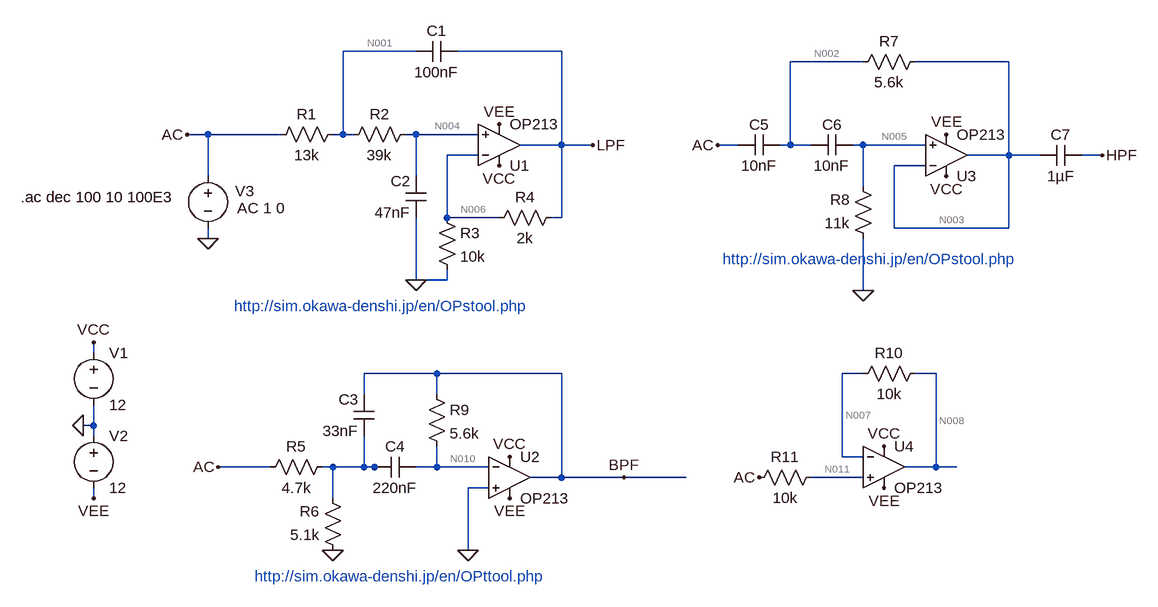
[diagram p0: schematic Active_Cross.asc]
Active_Cross.asc, the LTspice schematic file:
Version 4
SHEET 1 1848 680
WIRE 464 -432 352 -432
WIRE 688 -432 528 -432
WIRE 1152 -416 1040 -416
WIRE 1376 -416 1232 -416
WIRE 144 -304 112 -304
WIRE 256 -304 144 -304
WIRE 352 -304 352 -432
WIRE 352 -304 336 -304
WIRE 368 -304 352 -304
WIRE 464 -304 448 -304
WIRE 560 -304 464 -304
WIRE 688 -288 688 -432
WIRE 688 -288 624 -288
WIRE 736 -288 688 -288
WIRE 960 -288 928 -288
WIRE 1040 -288 1040 -416
WIRE 1040 -288 1024 -288
WIRE 1072 -288 1040 -288
WIRE 1152 -288 1136 -288
WIRE 1248 -288 1152 -288
WIRE 560 -272 512 -272
WIRE 1376 -272 1376 -416
WIRE 1376 -272 1312 -272
WIRE 1424 -272 1376 -272
WIRE 1520 -272 1488 -272
WIRE 1248 -256 1200 -256
WIRE 144 -240 144 -304
WIRE 464 -240 464 -304
WIRE 1152 -224 1152 -288
WIRE 512 -176 512 -272
WIRE 592 -176 512 -176
WIRE 688 -176 688 -288
WIRE 688 -176 672 -176
WIRE 1200 -160 1200 -256
WIRE 1376 -160 1376 -272
WIRE 1376 -160 1200 -160
WIRE 144 -144 144 -160
WIRE 464 -80 464 -176
WIRE 512 -80 512 -96
WIRE 512 -80 464 -80
WIRE 1152 -64 1152 -144
WIRE -32 32 -32 16
WIRE 496 64 384 64
WIRE 688 64 496 64
WIRE 1152 64 1120 64
WIRE 1264 64 1232 64
WIRE 384 96 384 64
WIRE 496 96 496 64
WIRE -32 144 -32 112
WIRE -32 144 -48 144
WIRE -32 160 -32 144
WIRE 1120 192 1120 64
WIRE 1152 192 1120 192
WIRE 240 208 160 208
WIRE 336 208 320 208
WIRE 384 208 384 160
WIRE 384 208 336 208
WIRE 400 208 384 208
WIRE 416 208 400 208
WIRE 496 208 496 176
WIRE 496 208 464 208
WIRE 576 208 496 208
WIRE 1264 208 1264 64
WIRE 1264 208 1216 208
WIRE 1296 208 1264 208
WIRE 688 224 688 64
WIRE 688 224 640 224
WIRE 784 224 688 224
WIRE 880 224 784 224
WIRE 1152 224 1072 224
WIRE 576 240 544 240
WIRE -32 256 -32 240
WIRE 336 256 336 208
WIRE 544 336 544 240
FLAG -48 144 0
FLAG -32 16 VCC
FLAG 592 -256 VCC
FLAG 592 -320 VEE
FLAG -32 256 VEE
FLAG 464 -80 0
FLAG 144 -144 0
FLAG 736 -288 LPF
FLAG 608 192 VCC
FLAG 608 256 VEE
FLAG 784 224 BPF
FLAG 112 -304 AC
FLAG 160 208 AC
FLAG 336 336 0
FLAG 544 336 0
FLAG 1280 -240 VCC
FLAG 1280 -304 VEE
FLAG 1152 -64 0
FLAG 1520 -272 HPF
FLAG 928 -288 AC
FLAG 1184 176 VCC
FLAG 1184 240 VEE
FLAG 992 224 AC
SYMBOL Opamps\\OP213 592 -224 M180
SYMATTR InstName U1
SYMBOL voltage -32 16 R0
SYMATTR InstName V1
SYMATTR Value 12
SYMBOL voltage -32 144 R0
SYMATTR InstName V2
SYMATTR Value 12
SYMBOL res 352 -320 R90
WINDOW 0 0 56 VBottom 2
WINDOW 3 32 56 VTop 2
SYMATTR InstName R1
SYMATTR Value 13k
SYMBOL res 464 -320 R90
WINDOW 0 0 56 VBottom 2
WINDOW 3 32 56 VTop 2
SYMATTR InstName R2
SYMATTR Value 39k
SYMBOL cap 528 -448 R90
WINDOW 0 0 32 VBottom 2
WINDOW 3 32 32 VTop 2
SYMATTR InstName C1
SYMATTR Value 100nF
SYMBOL cap 480 -176 R180
WINDOW 0 24 56 Left 2
WINDOW 3 24 8 Left 2
SYMATTR InstName C2
SYMATTR Value 47nF
SYMBOL res 496 -192 R0
SYMATTR InstName R3
SYMATTR Value 10k
SYMBOL res 688 -192 R90
WINDOW 0 0 56 VBottom 2
WINDOW 3 32 56 VTop 2
SYMATTR InstName R4
SYMATTR Value 2k
SYMBOL voltage 144 -256 R0
WINDOW 0 42 39 Left 2
WINDOW 123 45 65 Left 2
WINDOW 39 0 0 Left 0
SYMATTR InstName V3
SYMATTR Value2 AC 1 0
SYMATTR Value ""
SYMBOL Opamps\\OP213 608 160 R0
SYMATTR InstName U2
SYMBOL res 336 192 R90
WINDOW 0 0 56 VBottom 2
WINDOW 3 32 56 VTop 2
SYMATTR InstName R5
SYMATTR Value 4.7k
SYMBOL res 352 352 R180
WINDOW 0 36 76 Left 2
WINDOW 3 36 40 Left 2
SYMATTR InstName R6
SYMATTR Value 5.1k
SYMBOL cap 400 160 R180
WINDOW 0 24 56 Left 2
WINDOW 3 24 8 Left 2
SYMATTR InstName C3
SYMATTR Value 33nF
SYMBOL cap 400 224 R270
WINDOW 0 32 32 VTop 2
WINDOW 3 0 32 VBottom 2
SYMATTR InstName C4
SYMATTR Value 220nF
SYMBOL res 480 80 R0
SYMATTR InstName R9
SYMATTR Value 5.6k
SYMBOL Opamps\\OP213 1280 -208 M180
SYMATTR InstName U3
SYMBOL res 1248 -432 R90
WINDOW 0 0 56 VBottom 2
WINDOW 3 32 56 VTop 2
SYMATTR InstName R7
SYMATTR Value 5.6k
SYMBOL res 1168 -128 R180
WINDOW 0 36 76 Left 2
WINDOW 3 36 40 Left 2
SYMATTR InstName R8
SYMATTR Value 11k
SYMBOL cap 1024 -304 R90
WINDOW 0 0 32 VBottom 2
WINDOW 3 32 32 VTop 2
SYMATTR InstName C5
SYMATTR Value 10nF
SYMBOL cap 1072 -272 R270
WINDOW 0 32 32 VTop 2
WINDOW 3 0 32 VBottom 2
SYMATTR InstName C6
SYMATTR Value 10nF
SYMBOL cap 1488 -288 R90
WINDOW 0 0 32 VBottom 2
WINDOW 3 32 32 VTop 2
SYMATTR InstName C7
SYMATTR Value 1µF
SYMBOL Opamps\\OP213 1184 144 R0
SYMATTR InstName U4
SYMBOL res 1248 48 R90
WINDOW 0 0 56 VBottom 2
WINDOW 3 32 56 VTop 2
SYMATTR InstName R10
SYMATTR Value 10k
SYMBOL res 1088 208 R90
WINDOW 0 0 56 VBottom 2
WINDOW 3 32 56 VTop 2
SYMATTR InstName R11
SYMATTR Value 10k
TEXT -144 -208 Left 2 !.ac dec 100 10 100E3
TEXT 216 376 Left 2 ;http://sim.okawa-denshi.jp/en/OPttool.php
TEXT 184 -40 Left 2 ;http://sim.okawa-denshi.jp/en/OPstool.php
TEXT 936 -112 Left 2 ;http://sim.okawa-denshi.jp/en/OPstool.php

The netlist it stands for:
* Active_Cross.asc
XU1 N004 N006 VCC VEE LPF OP213  ; pins In+ In- V+ V- OUT
V1 VCC 0 12
V2 0 VEE 12
R1 N001 AC 13k
R2 N004 N001 39k
C1 LPF N001 100nF
C2 0 N004 47nF
R3 N006 0 10k
R4 LPF N006 2k
V3 AC 0 AC 1 0
XU2 0 N010 VCC VEE BPF OP213  ; pins In+ In- V+ V- OUT
R5 N009 AC 4.7k
R6 0 N009 5.1k
C3 N009 BPF 33nF
C4 N009 N010 220nF
R9 BPF N010 5.6k
XU3 N005 N003 VCC VEE N003 OP213  ; pins In+ In- V+ V- OUT
R7 N003 N002 5.6k
R8 0 N005 11k
C5 N002 AC 10nF
C6 N002 N005 10nF
C7 HPF N003 1µF
XU4 N011 N007 VCC VEE N008 OP213  ; pins In+ In- V+ V- OUT
R10 N008 N007 10k
R11 N011 AC 10k
.ac dec 100 10 100E3
* http://sim.okawa-denshi.jp/en/OPttool.php
* http://sim.okawa-denshi.jp/en/OPstool.php
* http://sim.okawa-denshi.jp/en/OPstool.php
.backanno
.end

* Results of the author's LTspice run, read from the files saved beside the schematic
* Operating Point, zero values left out:
*   V(vee) = -12 V
*   V(vcc) = 12 V
*   V(n006) = 13.74 mV
*   V(n004) = 13.77 mV
*   V(lpf) = 16.06 mV
*   V(n001) = 3.442 mV
*   V(n010) = -25.23 µV
*   V(bpf) = -1.228 mV
*   V(n003) = 2.888 mV
*   V(n005) = 2.913 mV
*   V(n002) = 2.888 mV
*   V(n007) = 2.623 mV
*   V(n011) = 2.648 mV
*   V(n008) = 474.7 µV
*   I(R11) = 264.8 nA
*   I(R10) = -214.8 nA
*   I(R8) = -264.8 nA
*   I(R9) = -214.8 nA
*   I(R4) = 1.16 µA
*   I(R3) = 1.374 µA
*   I(R2) = 264.8 nA
*   I(R1) = 264.8 nA
*   I(V3) = 529.6 nA
*   I(V2) = -6.34 mA
*   I(V1) = -6.343 mA
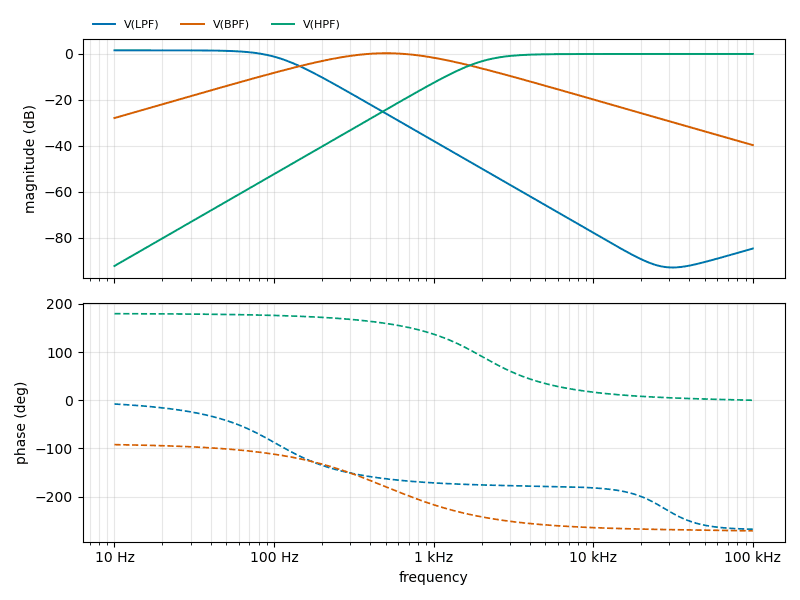
[diagram p1: AC Analysis of Active_Cross.asc, plotted from the saved traces]
* AC Analysis, 1 run:
*   V(LPF): 1.58 dB at 10 Hz, -84.70 dB at 100 kHz, peak 1.58 dB at 10 Hz, 3 dB below the peak at 103.1 Hz
*   V(BPF): -27.90 dB at 10 Hz, -39.67 dB at 100 kHz, peak 0.31 dB at 501.2 Hz, 3 dB below the peak at 211.9 Hz and 1.202 kHz
*   V(HPF): -92.28 dB at 10 Hz, -0.01 dB at 100 kHz, peak -0.01 dB at 100 kHz, 3 dB below the peak at 2.045 kHz